# EAGLE design obd25k80 (EAGLE 9.6.2)
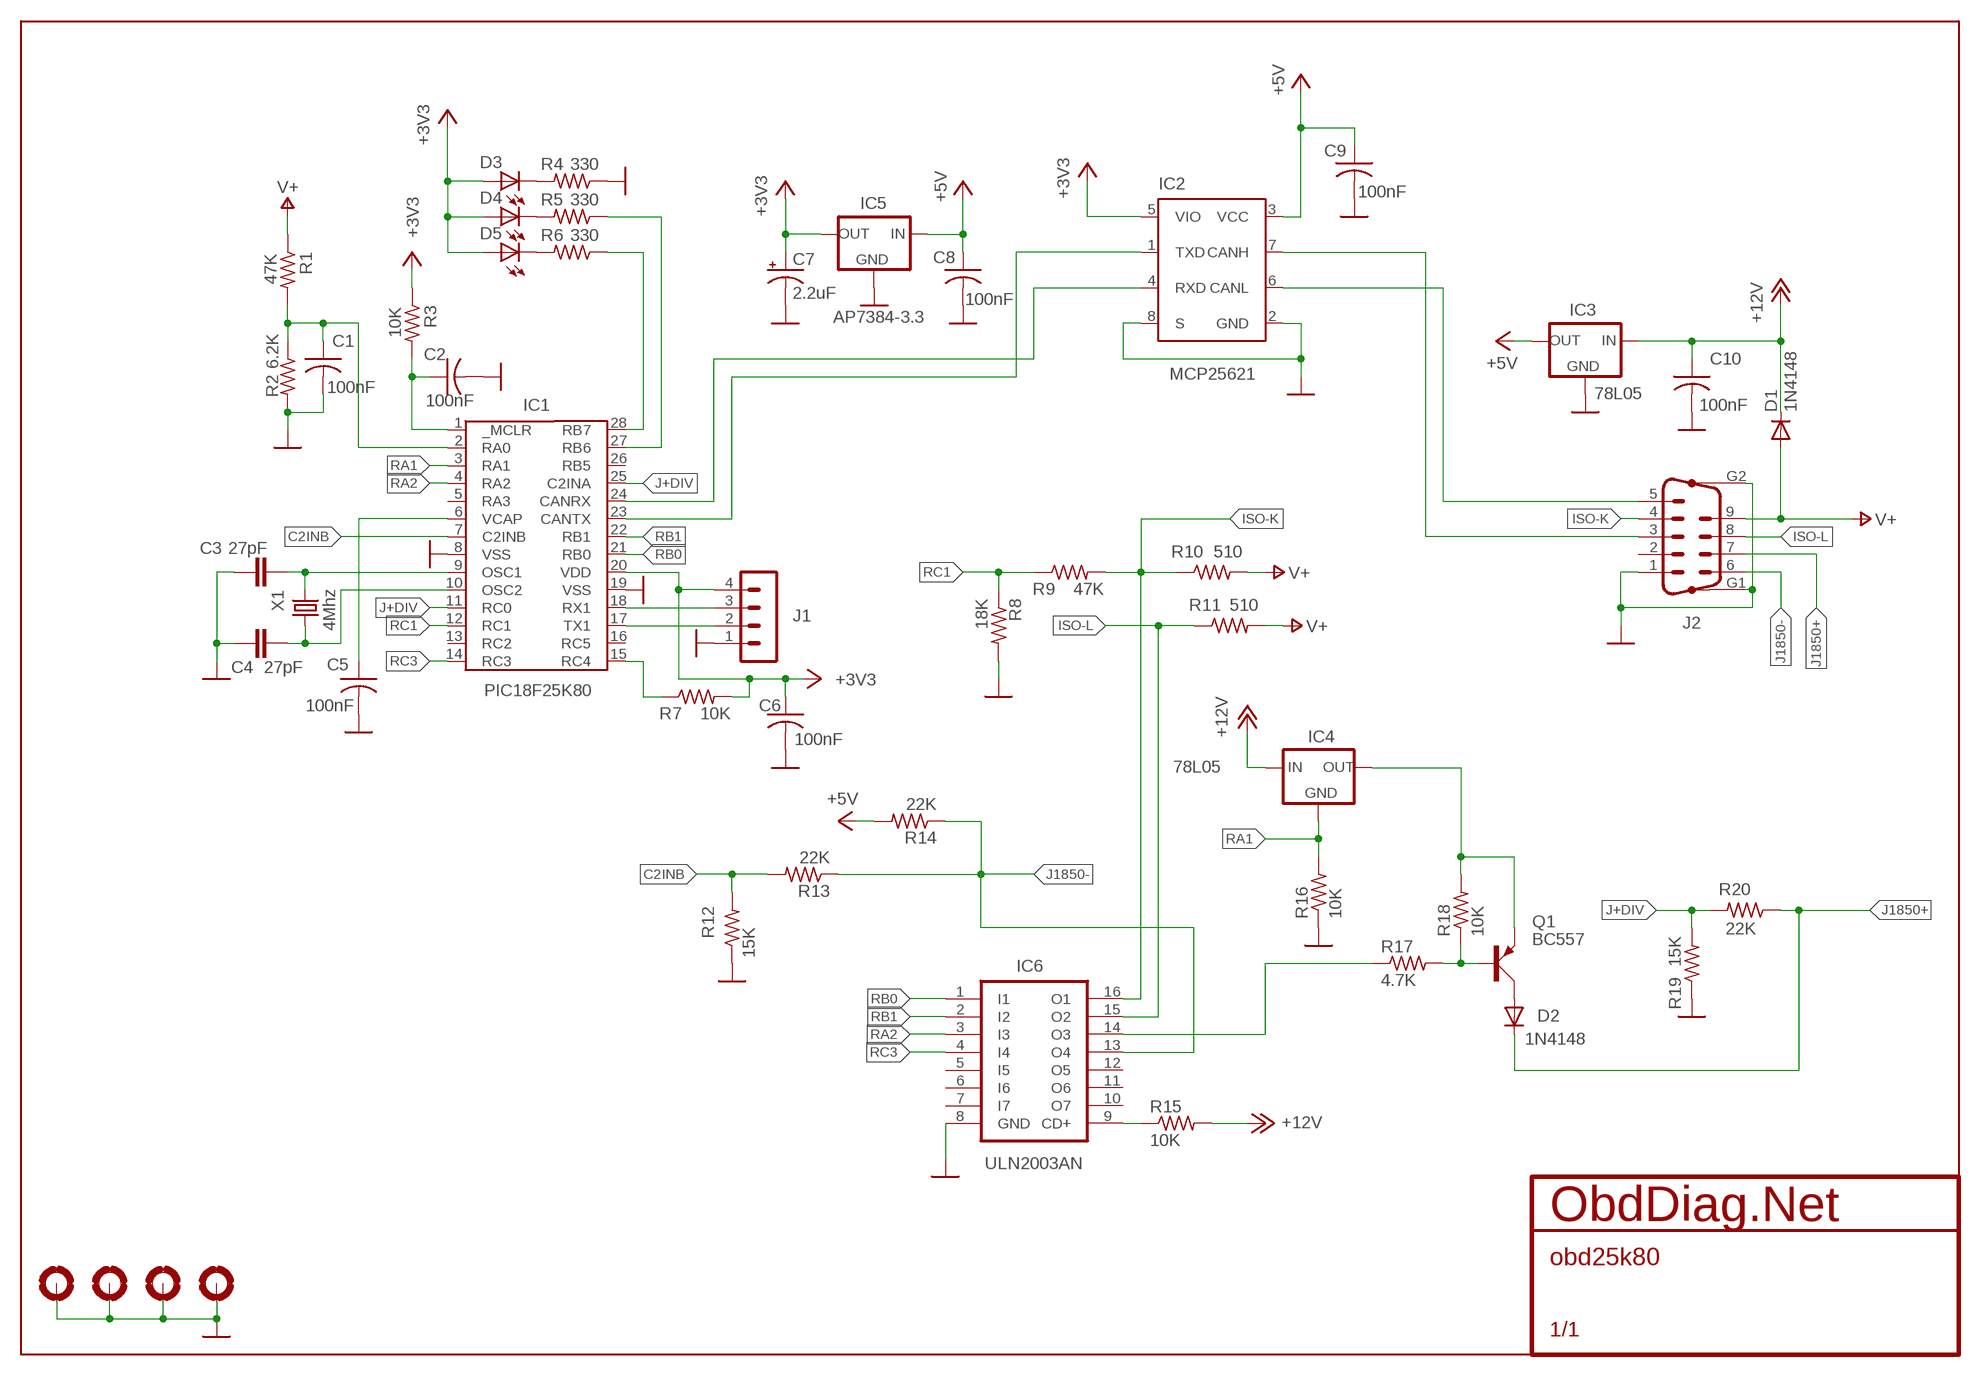
[diagram p0: schematic, sheet 1]

## Parts
C1  100nF  C-US050-025X075  [C050-025X075]
C2  100nF  C-US050-025X075  [C050-025X075]
C3  27pF  C2.5/2  [C2.5-2]
C4  27pF  C2.5/2  [C2.5-2]
C5  100nF  C-US050-025X075  [C050-025X075]
C6  100nF  C-US050-025X075  [C050-025X075]
C7  2.2uF  CPOL-USE2.5-5  [E2,5-5]
C8  100nF  C-US050-025X075  [C050-025X075]
C9  100nF  C-US050-025X075  [C050-025X075]
C10  100nF  C-US050-025X075  [C050-025X075]
D1  1N4148  1N4148M  [D035-10M]
D2  1N4148  1N4148M  [D035-10M]
D3  LED5MM  [LED5MM]
D4  LED5MM  [LED5MM]
D5  LED5MM  [LED5MM]
H1  MOUNT-PAD-ROUND2.8  [2,8-PAD]
H2  MOUNT-PAD-ROUND2.8  [2,8-PAD]
H3  MOUNT-PAD-ROUND2.8  [2,8-PAD]
H4  MOUNT-PAD-ROUND2.8  [2,8-PAD]
IC1  PIC18F25K80  PIC18F25K80-2  [DIL28]
IC2  MCP25621  [DIL8]
IC3  78L05  78LXX  [78LXX]
IC4  78L05  78LXX  [78LXX]
IC5  AP7384-3.3  AP7384  [TO92]
IC6  ULN2003AN  [DIL16]
J1  MA04-1  [MA04-1]
J2  DB9-M  M09HP  [M09HP]
Q1  BC557  [SOT54A]
R1  47K  R-US_0207/10  [0207/10]
R2  6.2K  R-US_0207/10  [0207/10]
R3  10K  R-US_0207/10  [0207/10]
R4  330  R-US_0207/10  [0207/10]
R5  330  R-US_0207/10  [0207/10]
R6  330  R-US_0207/10  [0207/10]
R7  10K  R-US_0207/10  [0207/10]
R8  18K  R-US_0207/10  [0207/10]
R9  47K  R-US_0207/10  [0207/10]
R10  510  R-US_0207/10  [0207/10]
R11  510  R-US_0207/10  [0207/10]
R12  15K  R-US_0207/10  [0207/10]
R13  22K  R-US_0207/10  [0207/10]
R14  22K  R-US_0207/10  [0207/10]
R15  10K  R-US_0207/10  [0207/10]
R16  10K  R-US_0207/10  [0207/10]
R17  4.7K  R-US_0207/10  [0207/10]
R18  10K  R-US_0207/10  [0207/10]
R19  15K  R-US_0207/10  [0207/10]
R20  22K  R-US_0207/10  [0207/10]
X1  4Mhz  CRYTALHC49S  [HC49/S]

## Nets
+3V3: C6.1 C7.+ D3.A D4.A D5.A IC1.20(VDD) IC2.5(VIO) IC5.3(OUT) J1.4 R3.1 R7.2
+5V: C8.1 C9.1 IC2.3(VCC) IC3.OUT IC5.1(IN) R14.2
+12V: C10.1 D1.C IC3.IN IC4.IN R15.2
C2INB: IC1.7(C2INB) R12.2 R13.2
CAN-H: IC2.7(CANH) J2.3
CAN-L: IC2.6(CANL) J2.5
GND: C1.2 C2.2 C3.1 C4.2 C5.2 C6.2 C7.- C8.2 C9.2 C10.2 H1.B2,8(MOUNT) H2.B2,8(MOUNT) H3.B2,8(MOUNT) H4.B2,8(MOUNT) IC1.8(VSS) IC1.19(VSS) IC2.2(GND) IC2.8(S) IC3.GND IC5.2(GND) IC6.8(GND) J1.1 J2.1 J2.G1 J2.G2 R2.2 R4.1 R8.2 R12.1 R16.1 R19.1
ISO-K: IC6.16(O1) J2.4 R9.2 R10.1
ISO-L: IC6.15(O2) J2.8 R11.1
J1850+: D2.C J2.7 R20.1
J1850-: IC6.13(O4) J2.6 R13.1 R14.1
J+DIV: IC1.11(RC0) IC1.25(C2INA) R19.2 R20.2
N$1: D3.K(C) R4.2
N$2: IC1.28(RB7) R6.1
N$3: IC1.15(RC4) R7.1
N$4: IC6.9(CD+) R15.1
N$6: D4.K(C) R5.2
N$7: C2.1 IC1.1(_MCLR) R3.2
N$10: D5.K(C) R6.2
N$11: IC1.27(RB6) R5.1
N$14: C5.1 IC1.6(VCAP)
N$16: IC1.18(RX1) J1.3
N$17: IC1.24(CANRX) IC2.4(RXD)
N$18: IC1.17(TX1) J1.2
N$21: C3.2 IC1.9(OSC1) X1.2
N$23: IC1.23(CANTX) IC2.1(TXD)
N$25: IC6.14(O3) R17.1
N$26: C1.1 IC1.2(RA0) R1.2 R2.1
N$30: Q1.B R17.2 R18.1
N$31: IC4.OUT Q1.E R18.2
N$32: D2.A Q1.C
N$41: C4.1 IC1.10(OSC2) X1.1
RA1: IC1.3(RA1) IC4.GND R16.2
RA2: IC1.4(RA2) IC6.3(I3)
RB0: IC1.21(RB0) IC6.1(I1)
RB1: IC1.22(RB1) IC6.2(I2)
RC1: IC1.12(RC1) R8.1 R9.1
RC3: IC1.14(RC3) IC6.4(I4)
V+: D1.A J2.9 R1.1 R10.2 R11.2
Unconnected: IC1.5(RA3) IC1.13(RC2) IC1.16(RC5) IC1.26(RB5) IC6.5(I5) IC6.6(I6) IC6.7(I7) IC6.10(O7) IC6.11(O6) IC6.12(O5) J2.2

## Library data of the parts
C1 C2 C5 C6 C8-C10 = rcl:C-US: CAPACITOR, American symbol; SPICEPREFIX: C
C3 C4 = capacitor-wima:C: CAPACITOR naming: grid - package width
C7 = rcl:CPOL-US: POLARIZED CAPACITOR, American symbol
D1 D2 = diode:1N4148: DIODE high speed (Philips)
D3-D5 = led:LED: LED OSRAM: - CHIPLED LG R971, LG N971, LY N971, LG Q971, LY Q971, LO R971, LY R971 LH N974, LH R974 LS Q976, LO Q976, LY Q976 LO Q996 - Hyper CHIPLED LW Q18S LB Q993, LB Q99A, LB R99A - SideLED LS A670, LO A670, LY A670, LG A670, LP A670 LB A673, LV A673, LT A673, LW A673 LH A674 LY A675 LS A676, LA A676, LO A676, LY A676, LW A676 LS A679, LY A679, LG A679 - Hyper Micro SIDELED® LS Y876, LA Y876, LO Y876, LY Y876 LT Y87S - SmartLED LW L88C, LW L88S LB L89C, LB L89S, LG L890 LS L89K, LO L89K, LY L89K LS L896, LA L896, LO L896, LY L896 - TOPLED LS T670, LO T670, LY T670, LG T670, LP T670 LSG T670, LSP T670, LSY T670, LOP T670, LYG T670 LG T671, LOG T671, LSG T671 LB T673, LV T673, LT T673, LW T673 LH T674 LS T676, LA T676, LO T676, LY T676, LB T676, LH T676, LSB T676, LW T676 LB T67C, LV T67C, LT T67C, LS T67K, LO T67K, LY T67K, LW E67C LS E67B, LA E67B, LO E67B, LY E67B, LB E67C, LV E67C, LT E67C LW T67C LS T679, LY T679, LG T679 LS T770, LO T770, LY T770, LG T770, LP T770 LB T773, LV T773, LT T773, LW T773 LH T774 LS E675, LA E675, LY E675, LS T675 LS T776, LA T776, LO T776, LY T776, LB T776 LHGB T686 LT T68C, LB T68C - Hyper Mini TOPLED® LB M676 - Mini TOPLED Santana® LG M470 LS M47K, LO M47K, LY M47K Source: http://www.osram.convergy.de LUXEON: - LUMILED® LXK2-PW12-R00, LXK2-PW12-S00, LXK2-PW14-U00, LXK2-PW14-V00 LXK2-PM12-R00, LXK2-PM12-S00, LXK2-PM14-U00 LXK2-PE12-Q00, LXK2-PE12-R00, LXK2-PE12-S00, LXK2-PE14-T00, LXK2-PE14-U00 LXK2-PB12-K00, LXK2-PB12-L00, LXK2-PB12-M00, LXK2-PB14-N00, LXK2-PB14-P00, LXK2-PB14-Q00 LXK2-PR12-L00, LXK2-PR12-M00, LXK2-PR14-Q00, LXK2-PR14-R00 LXK2-PD12-Q00, LXK2-PD12-R00, LXK2-PD12-S00 LXK2-PH12-R00, LXK2-PH12-S00 LXK2-PL12-P00, LXK2-PL12-Q00, LXK2-PL12-R00 Source: www.luxeon.com KINGBRIGHT: KA-3528ASYC Source: www.kingbright.com
H1-H4 = holes:MOUNT-PAD-ROUND: MOUNTING PAD, round
IC1 = pic18f2455:PIC18F25K80-2
IC2 = obddiag-net:MCP2562
IC3 IC4 = v-reg:78LXX: VOLTAGE REGULATOR
IC5 = obddiag-net:AP7384
IC6 = uln-udn:ULN2003A: DRIVER ARRAY
J1 = obddiag-net:MA04-1
J2 = con-subd:M09HP: SUB-D
Q1 = transistor-small-signal:BC557: PNP TRANSISTOR
R1-R20 = rcl:R-US_: RESISTOR, American symbol
X1 = crystal:CRYTAL: CRYSTAL

## Board
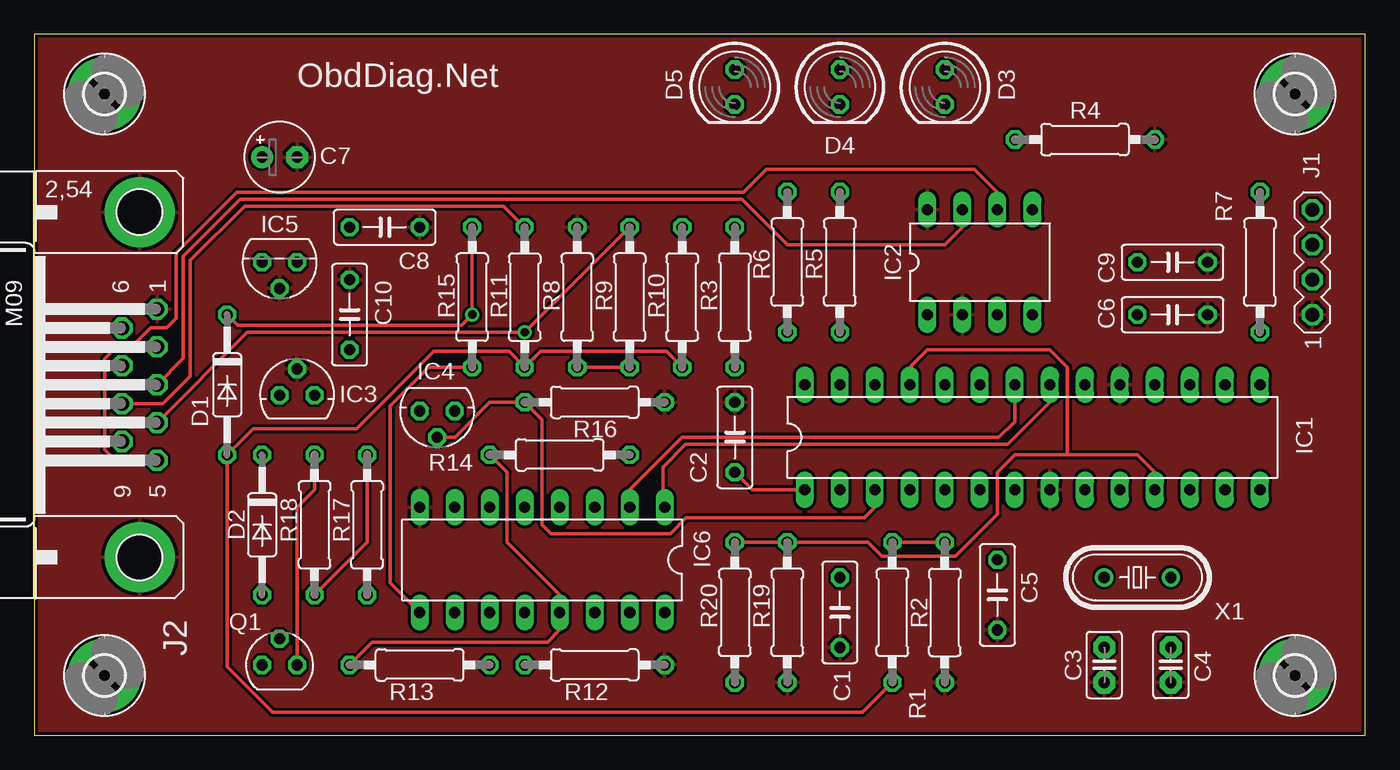
[diagram p1: board, top side]
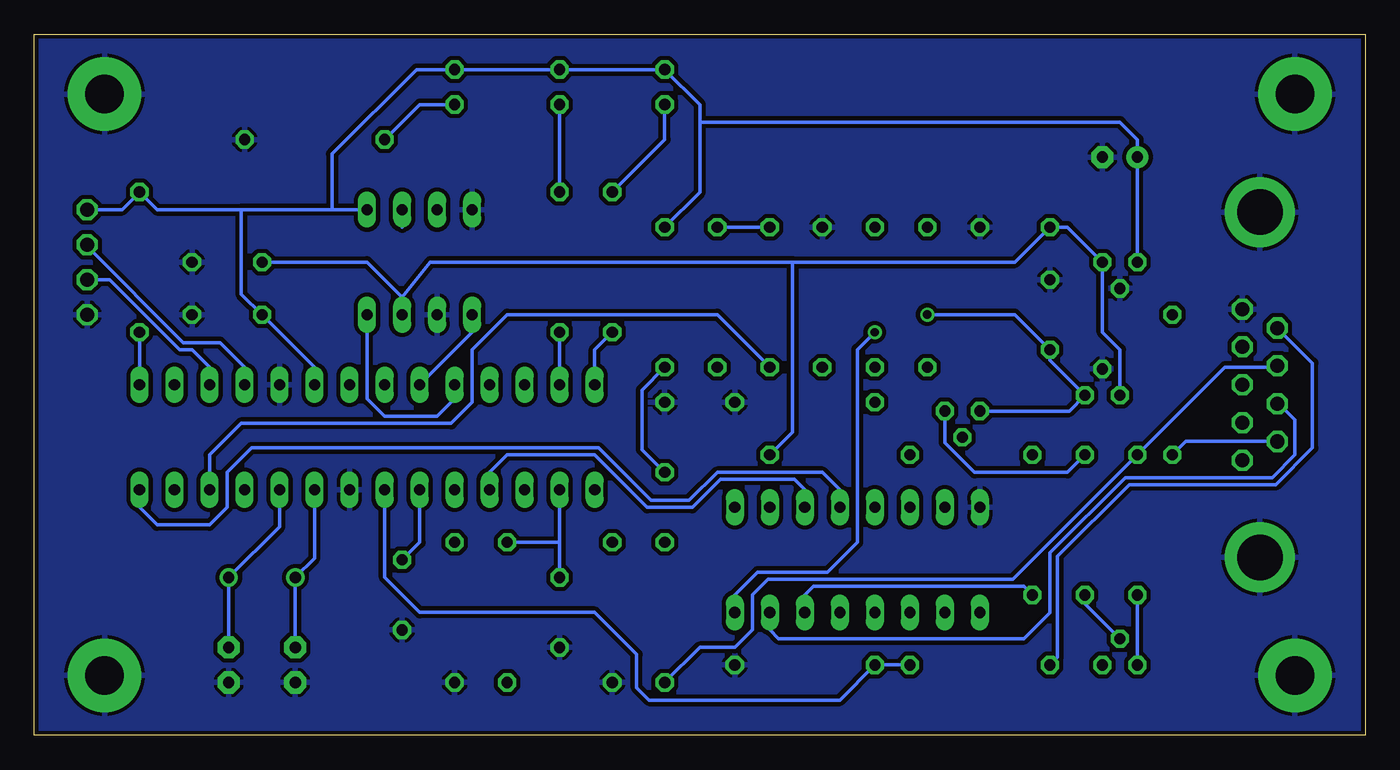
[diagram p2: board, bottom side, seen from below]

Size 96.52 x 50.8 mm. Coordinates in mm from the lower left corner, seen from the top.
Outline: 0,0 96.52,0 96.52,50.8 0,50.8 0,0
Copper layers (1*16): Top 0.035mm / dielectric 1.5mm / Bottom 0.035mm
Design rules "default *": minimum track width 10mil, minimum drill 24mil, track to track 8mil, track to pad 8mil, pad to pad 5mil, via to via 8mil, smd to smd 5mil, copper to edge 10mil, drill to drill 8mil, minimum pad ring 10mil, minimum via ring 8mil, stop-mask expansion 4mil, vias tented up to drill 0mil, thermal gap 10mil

### Footprints (pad centres in the part's own frame; a part is rotated, then mirrored left to right if it is on the bottom)
C050-025X075 = drill 0.813 octagon: 1 -2.54,0; 2 2.54,0
C2.5-2 = drill 0.813 pad 1.6 octagon: 1 -1.27,0; 2 1.27,0
E2,5-5 = drill 0.813 pad 1.6: + -1.27,0 | drill 0.813 pad 1.6 octagon: - 1.27,0
D035-10M = drill 0.813 octagon: A 5.08,0; C -5.08,0
LED5MM = drill 0.813 octagon: A -1.27,0; K 1.27,0
2,8-PAD = drill 2.8 pad 5.334: B2,8 0,0
DIL28 = drill 0.813 long: 1 -16.51,-3.81; 2 -13.97,-3.81; 3 -11.43,-3.81; 4 -8.89,-3.81; 5 -6.35,-3.81; 6 -3.81,-3.81; 7 -1.27,-3.81; 8 1.27,-3.81; 9 3.81,-3.81; 10 6.35,-3.81; 11 8.89,-3.81; 12 11.43,-3.81; 13 13.97,-3.81; 14 16.51,-3.81; 15 16.51,3.81; 16 13.97,3.81; 17 11.43,3.81; 18 8.89,3.81; 19 6.35,3.81; 20 3.81,3.81; 21 1.27,3.81; 22 -1.27,3.81; 23 -3.81,3.81; 24 -6.35,3.81; 25 -8.89,3.81; 26 -11.43,3.81; 27 -13.97,3.81; 28 -16.51,3.81
DIL8 = drill 0.813 long: 1 -3.81,-3.81; 2 -1.27,-3.81; 3 1.27,-3.81; 4 3.81,-3.81; 5 3.81,3.81; 6 1.27,3.81; 7 -1.27,3.81; 8 -3.81,3.81
78LXX = drill 0.813 octagon: GND 0,1.905; IN 1.27,0; OUT -1.27,0
TO92 = drill 0.813 octagon: 1 -1.27,0; 2 0,1.905; 3 1.27,0
DIL16 = drill 0.813 long: 1 -8.89,-3.81; 2 -6.35,-3.81; 3 -3.81,-3.81; 4 -1.27,-3.81; 5 1.27,-3.81; 6 3.81,-3.81; 7 6.35,-3.81; 8 8.89,-3.81; 9 8.89,3.81; 10 6.35,3.81; 11 3.81,3.81; 12 1.27,3.81; 13 -1.27,3.81; 14 -3.81,3.81; 15 -6.35,3.81; 16 -8.89,3.81
MA04-1 = drill 1.016 octagon: 1 -3.81,0; 2 -1.27,0; 3 1.27,0; 4 3.81,0
M09HP = drill 1.016 octagon: 1 -5.486,1.27; 2 -2.743,1.27; 3 0,1.27; 4 2.743,1.27; 5 5.486,1.27; 6 -4.115,-1.27; 7 -1.372,-1.27; 8 1.372,-1.27; 9 4.115,-1.27 | drill 3.302 pad 5.08: G1 -12.522,0; G2 12.522,0
SOT54A = drill 0.813 octagon: B 0,1.905; C -1.27,0; E 1.27,0
0207/10 = drill 0.813 octagon: 1 -5.08,0; 2 5.08,0
HC49/S = drill 0.813: 1 -2.413,0; 2 2.413,0

### Placement (x,y rotation side)
C1  58.42,8.89 270 top
C2  50.8,21.59 90 top
C3  77.6,5.08 90 top
C4  82.42,5.08 270 top
C5  69.85,10.16 270 top
C6  82.55,30.48 0 top
C7  17.78,41.91 0 top
C8  25.4,36.83 0 top
C9  82.55,34.29 0 top
C10  22.86,30.48 90 top
D1  13.97,25.4 270 top
D2  16.51,15.24 270 top
D3  66.04,46.99 270 top
D4  58.42,46.99 270 top
D5  50.8,46.99 270 top
H1  5.08,4.32 0 top
H2  5.08,46.48 0 top
H3  91.44,4.32 0 top
H4  91.44,46.48 0 top
IC1  72.39,21.59 0 top
IC2  68.58,34.29 0 top
IC3  19.05,24.64 0 top
IC4  29.21,23.5 180 top
IC5  17.78,34.29 180 top
IC6  36.83,12.7 180 top
J1  92.71,34.29 90 top
J2  7.62,25.4 270 top
Q1  17.78,5.08 0 top
R1  62.23,8.89 90 top
R2  66.04,8.89 270 top
R3  50.8,31.75 270 top
R4  76.2,43.18 180 top
R5  58.42,34.29 90 top
R6  54.61,34.29 90 top
R7  88.9,34.29 90 top
R8  39.37,31.75 90 top
R9  43.18,31.75 90 top
R10  46.99,31.75 270 top
R11  35.56,31.75 270 top
R12  40.64,5.08 180 top
R13  27.94,5.08 0 top
R14  38.1,20.32 0 top
R15  31.75,31.75 90 top
R16  40.64,24.13 180 top
R17  24.13,15.24 90 top
R18  20.32,15.24 90 top
R19  54.61,8.89 90 top
R20  50.8,8.89 90 top
X1  80.01,11.43 180 top

### Tracks (layer width: path | path; a pad name or v marks a point on that pad's centre or on a via)
+3V3
  Bottom 0.254: J1.4 90.17,38.1 R7.2 87.63,38.1 81.51,38.1 | R3.1 48.26,39.37 48.26,44.45 | 48.26,44.45 48.26,45.72 D5.A D4.A D3.A 68.81,48.26 74.93,42.14 74.93,38.1 | 81.51,38.1 81.51,31.98 C6.1 76.2,26.67 IC1.20 | IC2.5 74.93,38.1 | 74.93,38.1 81.51,38.1 | IC5.3 C7.+ 16.51,43.18 17.78,44.45 48.26,44.45
+5V
  Bottom 0.254: 69.85,31.75 IC2.3 | R14.2 41.53,21.97 41.53,34.29 | 69.85,31.75 67.82,34.29 41.53,34.29 | C9.1 72.39,34.29 69.85,31.75 | IC3.OUT 17.78,27.94 19.05,29.21 IC5.1 21.59,36.83 C8.1 25.4,34.29 41.53,34.29
+12V  (via drill 0.61)
  Top 0.254: R15.2 v31.75,30.48 30.99,29.72 14.73,29.72 D1.C
  Bottom 0.254: IC4.IN 21.46,23.5 IC3.IN 22.86,27.18 C10.1 25.4,30.48 v31.75,30.48
C2INB
  Bottom 0.254: R13.2 R12.2 38.1,2.54 51.94,2.54 52.83,3.43 52.83,5.84 55.88,8.89 68.58,8.89 71.12,11.43 IC1.7
CAN-H
  Top 0.254: J2.3 10.79,27.3 10.79,34.72 14.94,38.86 51.31,38.86 54.61,35.56 66.04,35.56 67.31,36.83 IC2.7
CAN-L
  Top 0.254: J2.5 5.87,19.91 5.08,20.7 5.08,27.3 5.9,28.12 7.01,28.12 8.44,29.54 9.6,29.54 10.29,30.23 10.29,34.99 14.67,39.37 51.44,39.37 53.09,41.02 68.2,41.02 69.85,39.37 IC2.6
  Bottom 0.254: 69.85,36.83 IC2.6
GND
  pour Bottom (isolate 0.305): 0,50.8 96.52,50.8 96.52,49.53 96.52,0 0,0 0,1.27
  pour Top: 0,0 0,50.8 96.52,50.8 96.52,0
ISO-K  (via drill 0.61)
  Top 0.254: J2.4 15.44,29.21 v35.56,29.21 R9.2
  Bottom 0.254: IC6.16 45.72,10.16 44.07,11.81 38.99,11.81 36.83,13.97 36.83,27.94 v35.56,29.21 | R9.2 R10.1
ISO-L
  Top 0.254: R11.1 34.04,38.35 15.24,38.35 11.3,34.42 11.3,26.01 9.32,24.03 J2.8
  Bottom 0.254: J2.8 6.25,24.03 5.08,22.86 5.08,20.32 6.73,18.67 17.4,18.67 22.86,13.21 22.86,8.86 24.74,6.99 42.55,6.99 43.18,7.62 IC6.15
J1850+
  Bottom 0.254: J2.7 6.45,26.67 10.16,26.67 D2.C 25.53,11.3 43.31,11.3 44.45,10.16 44.45,7.62 45.72,6.35 48.26,6.35 R20.1
J1850-
  Top 0.254: R13.1 24.51,6.73 37.21,6.73 38.1,7.62 IC6.13 38.1,10.16 34.29,13.97 34.29,19.05 R14.1
  Bottom 0.254: J2.6 3.81,26.98 3.81,20.83 6.48,18.16 17.09,18.16 22.3,12.95 22.3,5.64 R13.1
J+DIV
  Top 0.254: R20.2 R19.2 60.45,13.97 61.47,12.95 66.8,12.95 69.85,16 69.85,19.05 71.12,20.32 74.93,20.32 | IC1.25 63.5,26.67 64.77,27.94 73.66,27.94 74.93,26.67 74.93,20.32 | IC1.11 81.28,19.05 80.01,20.32 74.93,20.32
N$1
  Bottom 0.254: D3.K 68.58,45.72 R4.2
N$2
  Bottom 0.254: IC1.28 55.88,27.94 R6.1
N$3
  Bottom 0.254: R7.1 IC1.15
N$4
  Top 0.254: R15.1 28.57,26.67 25.78,23.88 25.78,11.05 IC6.9
N$6
  Bottom 0.254: R5.2 D4.K
N$7
  Top 0.254: IC1.1 52.07,17.78 C2.1
  Bottom 0.254: C2.1 52.45,20.7 52.45,25.02 R3.2
N$10
  Bottom 0.254: R6.2 50.8,43.18 D5.K
N$11
  Bottom 0.254: IC1.27 R5.1
N$14
  Bottom 0.254: C5.1 68.58,13.97 IC1.6
N$16
  Bottom 0.254: J1.3 92.71,35.43 85.72,28.45 83.06,28.45 81.28,26.67 IC1.18
N$17
  Bottom 0.254: IC1.24 66.04,24.38 67.31,23.11 71.12,23.11 72.39,24.38 IC2.4
N$18
  Bottom 0.254: J1.2 91.06,33.02 85.98,27.94 85.09,27.94 83.82,26.67 IC1.17
N$21  (via drill 0.61)
  Top 0.254: v77.6,6.48 C3.2
  Bottom 0.254: IC1.9 76.2,12.83 X1.2 v77.6,6.48
N$23
  Bottom 0.254: IC1.23 64.77,29.21 IC2.1
N$25
  Bottom 0.254: R17.1 24.77,10.79 40.01,10.79 40.64,10.16 IC6.14
N$26
  Top 0.254: R1.2 R2.1
  Bottom 0.254: IC1.2 C1.1 58.42,13.97 R1.2
N$30
  Top 0.254: R18.1 24.13,13.97 R17.2
  Bottom 0.254: Q1.B 20.32,9.53 R18.1
N$31
  Top 0.254: R18.2 20.32,17.78 19.05,16.51 Q1.E
  Bottom 0.254: IC4.OUT 30.48,21.2 28.32,19.05 21.59,19.05 R18.2
N$32
  Bottom 0.254: Q1.C D2.A
N$41  (via drill 0.61)
  Top 0.254: v82.42,6.48 C4.1
  Bottom 0.254: v82.42,6.48 X1.1 78.74,15.11 IC1.10
RA1
  Top 0.254: IC4.GND 30.51,21.59 33.02,24.13 R16.2 36.83,22.86 36.83,15.24 37.47,14.61 42.77,14.61 43.18,14.61 46.13,14.61 47.27,15.75 60.2,15.75 60.96,16.51 IC1.3
RA2
  Bottom 0.254: IC1.4 63.5,19.05 62.23,20.32 55.88,20.32 52.07,16.51 48.8,16.51 46.77,18.54 41.4,18.54 40.64,17.78 IC6.3
RB0
  Top 0.254: IC1.21 73.66,24.13 70.61,21.08 47.24,21.08 45.59,19.43 45.59,16.64 IC6.1
RB1
  Top 0.254: IC1.22 71.12,22.73 69.98,21.59 46.99,21.59 43.18,17.78 IC6.2
RC1
  Top 0.254: R8.1 R9.1
  Bottom 0.254: IC1.12 83.82,20.32 81.53,22.61 66.29,22.61 64.77,24.13 64.77,27.94 62.23,30.48 46.99,30.48 R9.1
RC3
  Bottom 0.254: IC1.14 88.9,16.51 87.63,15.24 83.82,15.24 82.55,16.51 82.55,19.05 80.77,20.83 55.61,20.83 51.8,17.02 49.02,17.02 46.99,19.05 39.37,19.05 38.1,17.78 IC6.4
V+
  Top 0.254: R1.1 60.07,1.65 17.27,1.65 13.97,4.95 D1.A 15.88,22.23 23.36,22.23 28.94,27.81 34.42,27.81 R11.2 36.7,27.81 45.85,27.81 R10.2
  Bottom 0.254: J2.9 13.01,21.29 D1.A

### Text on the board
tNames: ObdDiag.Net